# EAGLE design Electric_Imp_imp002_Breakout (EAGLE 7.2.0)
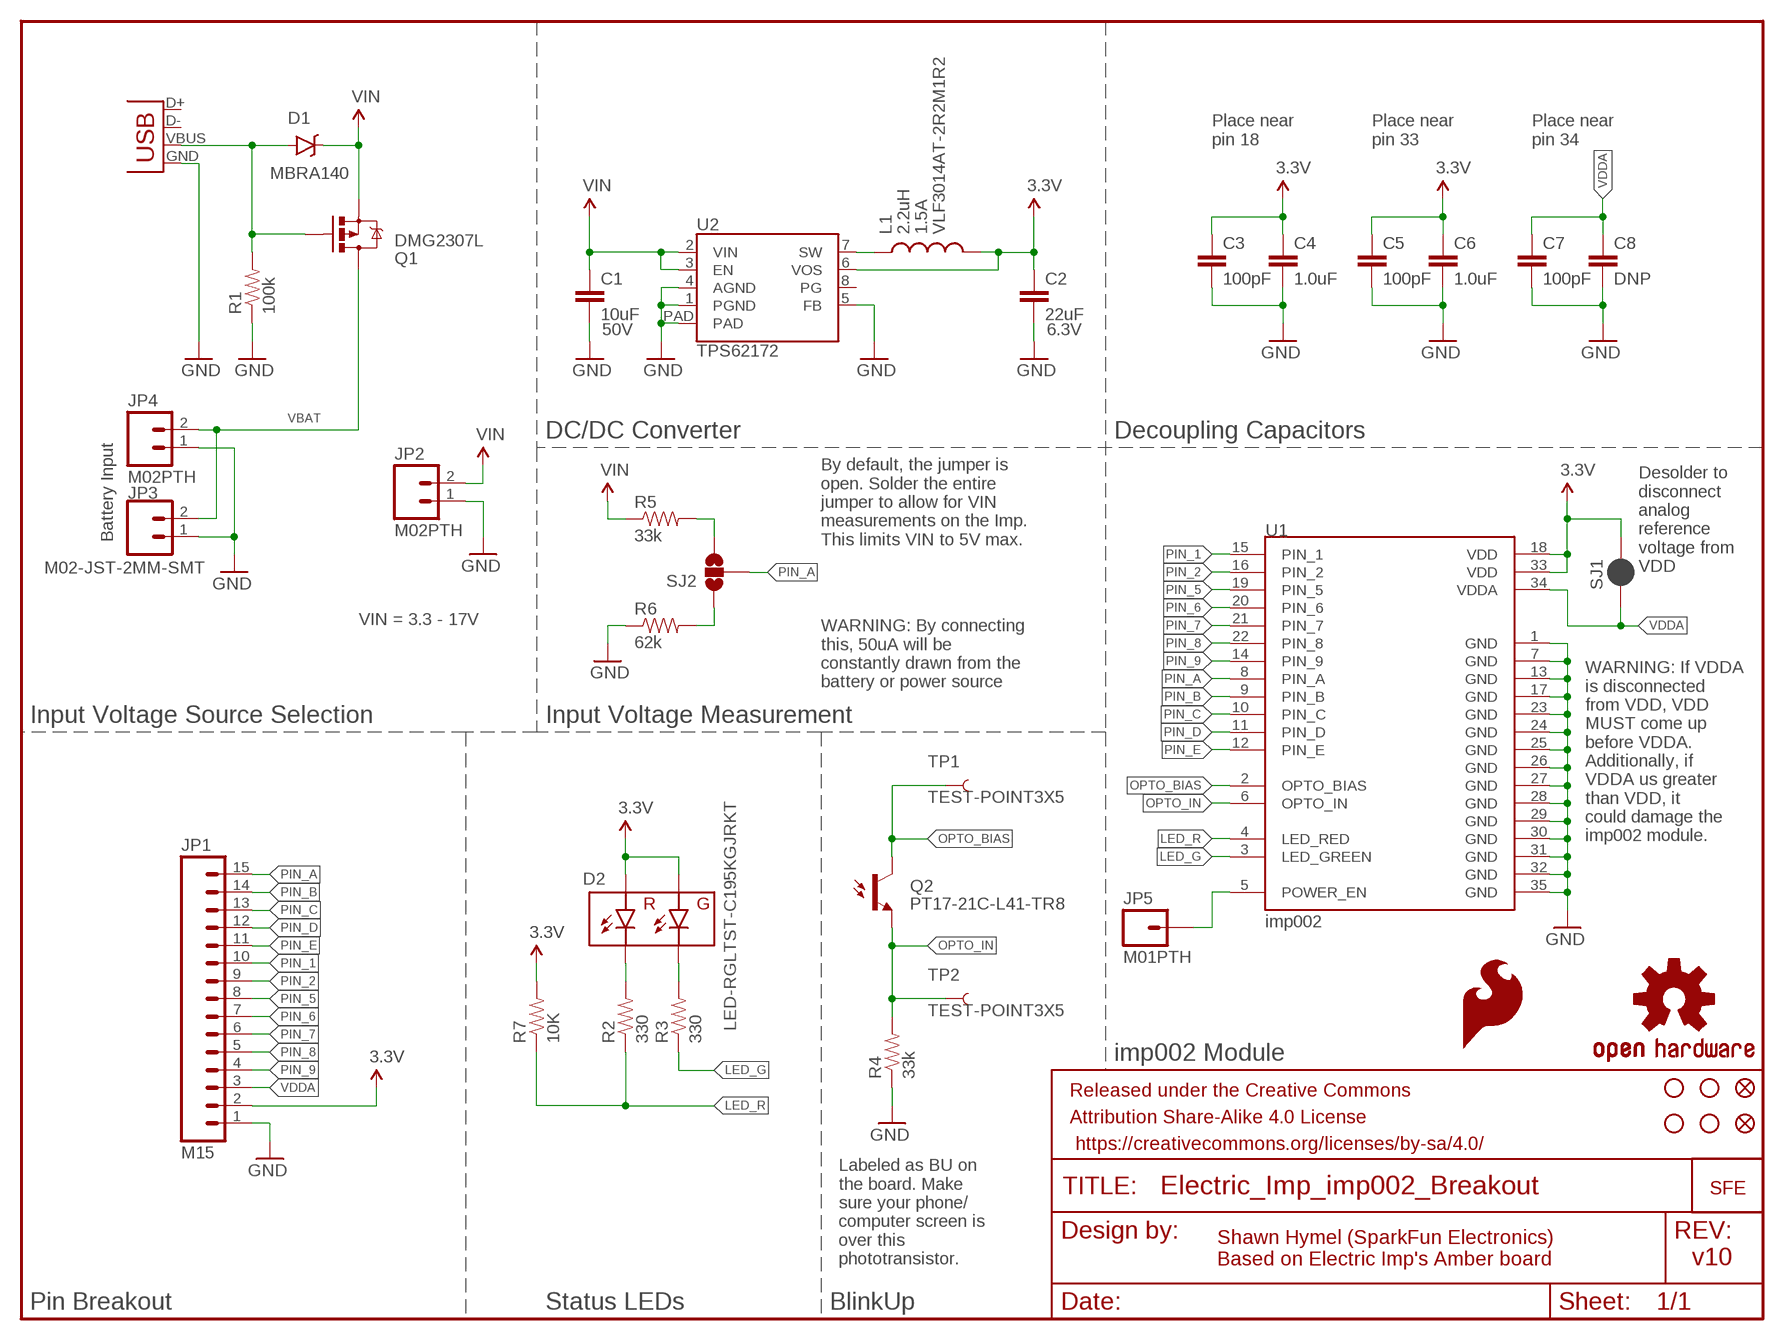
[diagram p0: schematic, sheet 1]

## Parts
C1  10uF  CAP1210  [1210]
C2  22uF  CAP0805  [0805]
C3  100pF  CAP0603-CAP  [0603-CAP]
C4  1.0uF  1.0UF-16V-10%(0603)  [0603-CAP]
C5  100pF  CAP0603-CAP  [0603-CAP]
C6  1.0uF  1.0UF-16V-10%(0603)  [0603-CAP]
C7  100pF  CAP0603-CAP  [0603-CAP]
C8  DNP  CAP0603-CAP  [0603-CAP]
D1  MBRA140  DIODE-SCHOTTKY-MBRA140  [SMA-DIODE]
D2  LED-RGLTST-C195KGJRKT  [LTST-C195KGJRKT]
FID1  FIDUCIAL1X2  [FIDUCIAL-1X2]
FID2  FIDUCIAL1X2  [FIDUCIAL-1X2]
FRAME1  FRAME-LETTER  [CREATIVE_COMMONS]
JP1  M15  [1X15]
JP2  M02PTH  [1X02]
JP3  M02-JST-2MM-SMT  [JST-2-SMD]
JP4  M02PTH  [1X02]
JP5  M01PTH  [1X01]
L1  2.2uH  INDUCTORVLF4012A  [VLF4012A]
LOGO1  OSHW-LOGOS  [OSHW-LOGO-S]
LOGO2  SFE_LOGO_FLAME.1_INCH  [SFE_LOGO_FLAME_.1]
Q1  DMG2307L  MOSFET-PCHANNELDMG2307L  [SOT23-3]
Q2  PT17-21C-L41-TR8  PHOTOTRANSISTORPT17-21C-L41-TR8  [PT17-21C-L41-TR8]
R1  100k  100KOHM1/10W1%(0603)  [0603-RES]
R2  330  330OHM1/10W1%(0603)  [0603-RES]
R3  330  330OHM1/10W1%(0603)  [0603-RES]
R4  33k  33KOHM1/10W1%(0603)  [0603-RES]
R5  33k  33KOHM1/10W1%(0603)  [0603-RES]
R6  62k  RESISTOR0603  [0603-RES]
R7  10K  10KOHM1/10W1%(0603)0603  [0603-RES]
SJ1  JUMPER-PAD-2-NC_BY_PASTE  [PAD-JUMPER-2-NC_BY_PASTE_YES_SILK]
SJ2  JUMPER-PAD-3-NOFULL_BOX_SILK  [PAD-JUMPER-3-NO_YES_SILK_FULL_BOX]
STANDOFF1  STAND-OFF  [STAND-OFF]
STANDOFF2  STAND-OFF  [STAND-OFF]
STANDOFF3  STAND-OFF  [STAND-OFF]
STANDOFF4  STAND-OFF  [STAND-OFF]
TP1  TEST-POINT3X5  [PAD.03X.05]
TP2  TEST-POINT3X5  [PAD.03X.05]
U1  imp002  ELECTRIC_IMP_IMP002  [ELECTRIC_IMP_IMP002]
U2  TPS62172  [WSON-8-PAD]
U$9  SFE_LOGO_NAME_WEB  [SFE-NEW-WEBLOGO]
X1  USBSMD  [USB-MINIB]

## Nets
3.3V: C2.1 C3.1 C4.1 C5.1 C6.1 D2.P$1(GA) D2.P$2(RA) JP1.2 L1.P$2 R7.2 SJ1.2 U1.18(VDD) U1.33(VDD) U2.6(VOS)
GND: C1.2 C2.2 C3.2 C4.2 C5.2 C6.2 C7.2 C8.2 JP1.1 JP2.1 JP3.1 JP4.1 R1.1 R4.1 R6.1 U1.1(GND) U1.7(GND) U1.13(GND) U1.17(GND) U1.23(GND) U1.24(GND) U1.25(GND) U1.26(GND) U1.27(GND) U1.28(GND) U1.29(GND) U1.30(GND) U1.31(GND) U1.32(GND) U1.35(GND) U2.1(PGND) U2.4(AGND) U2.5(FB) U2.PAD X1.GND
LED_G: R3.1 U1.3(LED_GREEN)
LED_R: R2.1 R7.1 U1.4(LED_RED)
N$1: L1.P$1 U2.7(SW)
N$2: D1.A Q1.1(G) R1.2 X1.VBUS
N$4: D2.P$4(RC) R2.2
N$5: D2.P$3(GC) R3.2
N$6: R5.2 SJ2.3
N$7: R6.2 SJ2.1
OPTO_BIAS: Q2.C TP1.P$1 U1.2(OPTO_BIAS)
OPTO_IN: Q2.E R4.2 TP2.P$1 U1.6(OPTO_IN)
PIN_1: JP1.10 U1.15(PIN_1)
PIN_2: JP1.9 U1.16(PIN_2)
PIN_5: JP1.8 U1.19(PIN_5)
PIN_6: JP1.7 U1.20(PIN_6)
PIN_7: JP1.6 U1.21(PIN_7)
PIN_8: JP1.5 U1.22(PIN_8)
PIN_9: JP1.4 U1.14(PIN_9)
PIN_A: JP1.15 SJ2.2 U1.8(PIN_A)
PIN_B: JP1.14 U1.9(PIN_B)
PIN_C: JP1.13 U1.10(PIN_C)
PIN_D: JP1.12 U1.11(PIN_D)
PIN_E: JP1.11 U1.12(PIN_E)
POWER_EN: JP5.1 U1.5(POWER_EN)
VBAT: JP3.2 JP4.2 Q1.3(D)
VDDA: C7.1 C8.1 JP1.3 SJ1.1 U1.34(VDDA)
VIN: C1.1 D1.C JP2.2 Q1.2(S) R5.1 U2.2(VIN) U2.3(EN)
Unconnected: U2.8(PG) X1.D+ X1.D-

## Notes on the sheet
- Place near
  pin 18
- Place near
  pin 33
- Place near
  pin 34
- 1.5A | VLF3014AT-2R2M1R2
- 50V | 6.3V
- DC/DC Converter | Decoupling Capacitors
- Battery Input
- By default, the jumper is
  open. Solder the entire
  jumper to allow for VIN
  measurements on the Imp.
  This limits VIN to 5V max.
- Desolder to 
  disconnect
  analog
  reference 
  voltage from 
  VDD
- VIN = 3.3 - 17V
- WARNING: If VDDA
  is disconnected 
  from VDD, VDD 
  MUST come up
  before VDDA.
  Additionally, if
  VDDA us greater
  than VDD, it 
  could damage the
  imp002 module.
- WARNING: By connecting
  this, 50uA will be
  constantly drawn from the
  battery or power source
- Input Voltage Source Selection | Input Voltage Measurement
- imp002 Module
- Labeled as BU on
  the board. Make
  sure your phone/
  computer screen is
  over this
  phototransistor.
- Shawn Hymel (SparkFun Electronics)
  Based on Electric Imp's Amber board
- v10
- Pin Breakout | Status LEDs | BlinkUp

## Library data of the parts
C1 = SparkFun-Passives:CAP: Capacitor Standard 0603 ceramic capacitor, and 0.1" leaded capacitor.
C2 = SparkFun-Passives:CAP: Capacitor Standard 0603 ceramic capacitor, and 0.1" leaded capacitor.; PROD_ID: CAP-08402
C3 C5 C7 = SparkFun-Capacitors:CAP: Capacitor Standard 0603 ceramic capacitor, and 0.1" leaded capacitor.; PROD_ID: CAP-07883
C4 C6 = SparkFun-Capacitors:1.0UF-16V-10%(0603): CAP-00868; PROD_ID: CAP-00868
C8 = SparkFun-Capacitors:CAP: Capacitor Standard 0603 ceramic capacitor, and 0.1" leaded capacitor.
D1 = SparkFun-DiscreteSemi:DIODE-SCHOTTKY: Schottky diodes in SFE's production catalog BAT20J 1A 23V 0.62Vf RB751 120mA 40V 0.37Vf PMEG4005EJ 0.5A 40V 0.42Vf MBRA140 1A 40V 0.5Vf B340A 3A 40V SMA; PROD_ID: DIO-08053
D2 = SparkFun-LED:LED-RG; PROD_ID: DIO-12140
FID1 FID2 = SparkFun-Aesthetics:FIDUCIAL: Fiducial Alignment Points Various fiducial points for machine vision alignment.
FRAME1 = SparkFun-Aesthetics:FRAME-LETTER: Schematic Frame Standard 8.5x11 US Letter frame
JP1 = SparkFun-Connectors:M15: Header 15 Standard 15-pin 0.1" header. Use with straight break away headers (SKU : PRT-00116), right angle break away headers (PRT-00553), swiss pins (PRT-00743), machine pins (PRT-00117), and female headers (PRT-00115).
JP2 JP4 = SparkFun-Connectors:M02: Standard 2-pin 0.1" header. Use with - straight break away headers ( PRT-00116) - right angle break away headers (PRT-00553) - swiss pins (PRT-00743) - machine pins (PRT-00117) - female headers (PRT-00115) Molex polarized connector foot print use with: PRT-08233 with associated crimp pins and housings. 2.54_SCREWTERM for use with PRT-10571. 3.5mm Screw Terminal footprints for PRT-08084 5mm Screw Terminal footprints for use with PRT-08432
JP3 = SparkFun-Connectors:M02: Standard 2-pin 0.1" header. Use with - straight break away headers ( PRT-00116) - right angle break away headers (PRT-00553) - swiss pins (PRT-00743) - machine pins (PRT-00117) - female headers (PRT-00115) Molex polarized connector foot print use with: PRT-08233 with associated crimp pins and housings. 2.54_SCREWTERM for use with PRT-10571. 3.5mm Screw Terminal footprints for PRT-08084 5mm Screw Terminal footprints for use with PRT-08432; PROD_ID: CONN-08352
JP5 = SparkFun-Connectors:M01: Header 1 Standard 1-pin 0.1" header. Use with straight break away headers (SKU : PRT-00116), right angle break away headers (PRT-00553), swiss pins (PRT-00743), machine pins (PRT-00117), and female headers (PRT-00115).
L1 = SparkFun-Passives:INDUCTOR: Inductors Basic Inductor/Choke - 0603 and 1206. Footprints are not proven and vary greatly between part numbers. SRN6045- 33uH, 20% 1.4A SDR0403-560KL - 56uH, 10%, 500mA RMS/740mA peak
LOGO1 = SparkFun-Aesthetics:OSHW-LOGO: Open Source Hardware Logo This logo indicates the piece of hardware it is found on incorporates a OSHW license and/or adheres to the definition of open source hardware found here: http://freedomdefined.org/OSHW
LOGO2 = SparkFun-Aesthetics:SFE_LOGO_FLAME: SFE Logo, flame only This is the SparkFun flame logo. The logo on the schematic will always be the same size; the package variant is the height of the flame. Default layer for the logo on the board is tSilk.
Q1 = SparkFun-DiscreteSemi:MOSFET-PCHANNEL: Generic PMOSFET IRLML2244 - TRANS-11153 (SOT-23 -20V -4.3A) (1.Gate 2.Source 3.Drain) FQP27P06 - COM-10349 <http://www.sparkfun.com/products/10349> (TO-220 -60V -27A) (1.Gate 2.Source 3.Drain); PROD_ID: TRANS-11308; VALUE: 2.5A/30V
Q2 = SparkFun-DiscreteSemi:PHOTOTRANSISTOR; PROD_ID: TRANS-12141
R1 = SparkFun-Resistors:100KOHM1/10W1%(0603): RES-07828; PROD_ID: RES-07828
R2 R3 = SparkFun-Resistors:330OHM1/10W1%(0603): RES-00818; PROD_ID: RES-00818
R4 R5 = SparkFun-Resistors:33KOHM1/10W1%(0603): RES-08416; PROD_ID: RES-08416
R6 = SparkFun-Resistors:RESISTOR: Resistor Basic schematic elements and footprints for 0603, 1206, and PTH resistors.; PROD_ID: RES-09993
R7 = SparkFun-Resistors:10KOHM1/10W1%(0603): RES-00824; PROD_ID: RES-00824
SJ1 = SparkFun-Passives:JUMPER-PAD-2-NC_BY_PASTE
SJ2 = SparkFun-Passives:JUMPER-PAD-3-NO
STANDOFF1-STANDOFF4 = SparkFun-Electromechanical:STAND-OFF: #4 Stand Off This is the mechanical footprint for a #4 phillips button head screw. Use the keepout ring to avoid running the screw head into surrounding components. SKU : PRT-00447
TP1 TP2 = SparkFun-Passives:TEST-POINT: Bare copper test points for troubleshooting or ICT
U1 = SparkFun-DigitalIC:ELECTRIC_IMP_IMP002; PROD_ID: IC-12130
U2 = SparkFun-PowerIC:TPS62172: Texas Instruments TPS62172 3-17V 0.5A Step-Down Converter with DCS control. Available in adjustable and fixed output voltage versions. Is packaged in an 8-pin WSON package measuring 2 × 2 mm (DSG). See a 3.3V fixed output version of this chip in action on the Electric Imp Breakout Board <https://www.sparkfun.com/products/11400>. Datasheet <http://www.ti.com/lit/gpn/tps62172>; PROD_ID: IC-11307
U$9 = SparkFun-Aesthetics:SFE_LOGO_NAME_WEB: SparkFun.com board silk.
X1 = SparkFun-Connectors:USB: USB Connectors USB-B-PTH is fully proven SKU : PRT-00139/CONN-08278 USB-miniB is fully proven SKU : PRT-00587 USB-A-PCB is untested. USB-A-H is throughly reviewed, but untested. Spark Fun Electronics SKU : PRT-00437 USB-B-SMT is throughly reviewed, but untested. Needs silkscreen touching up. USB-A-S has not been used/tested USB-MB-H has not been used/tested USB-MICROB has been used. CONN-09505; PROD_ID: CONN-08193

## Board
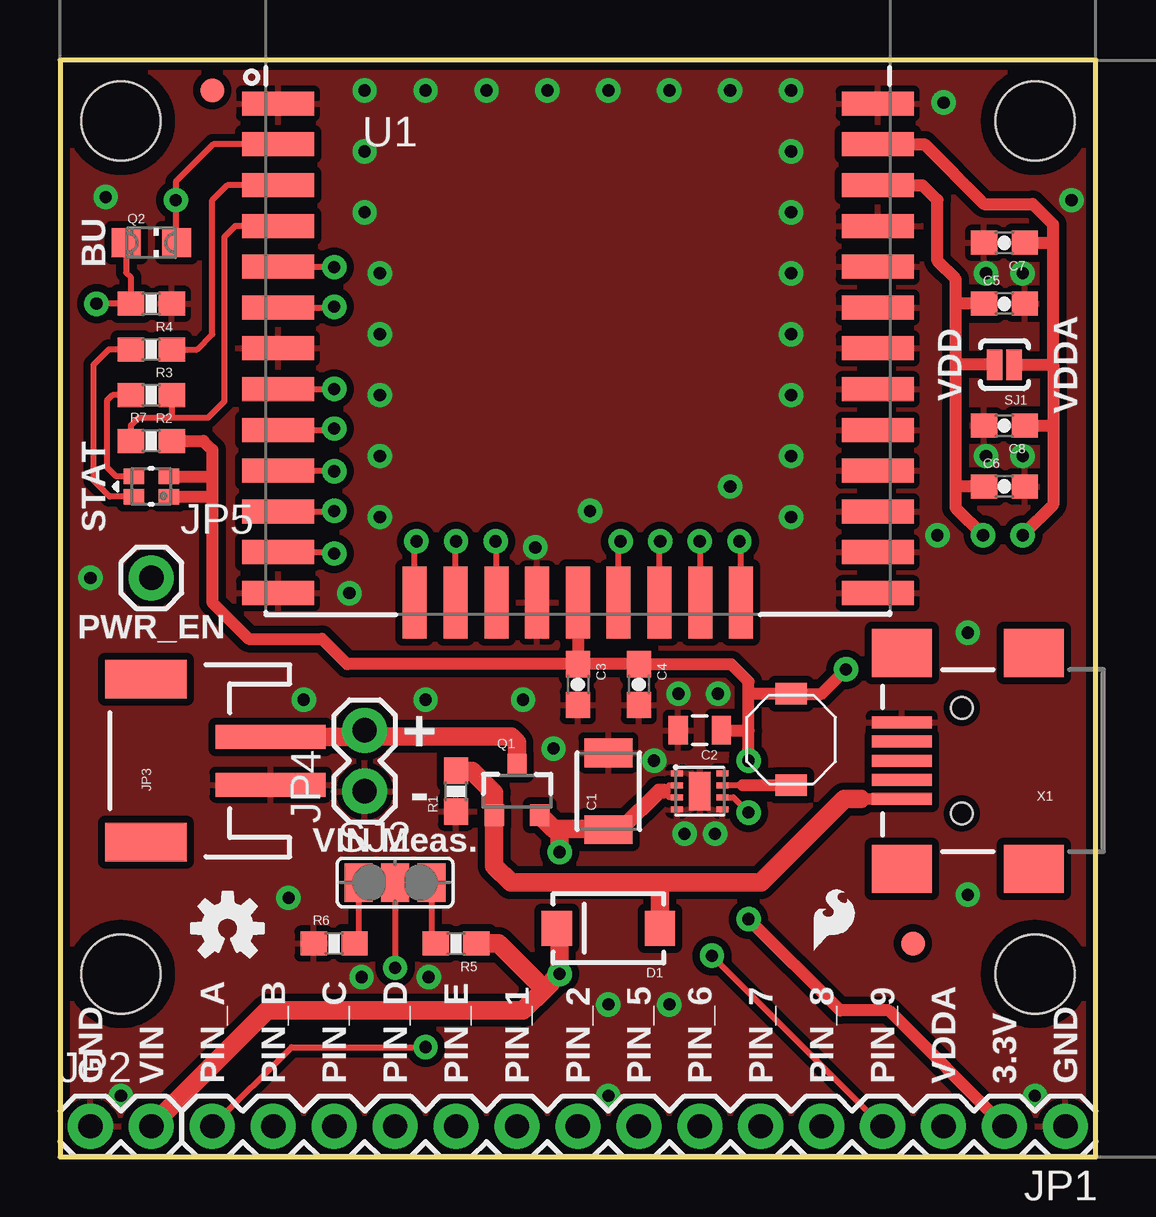
[diagram p1: board, top side]
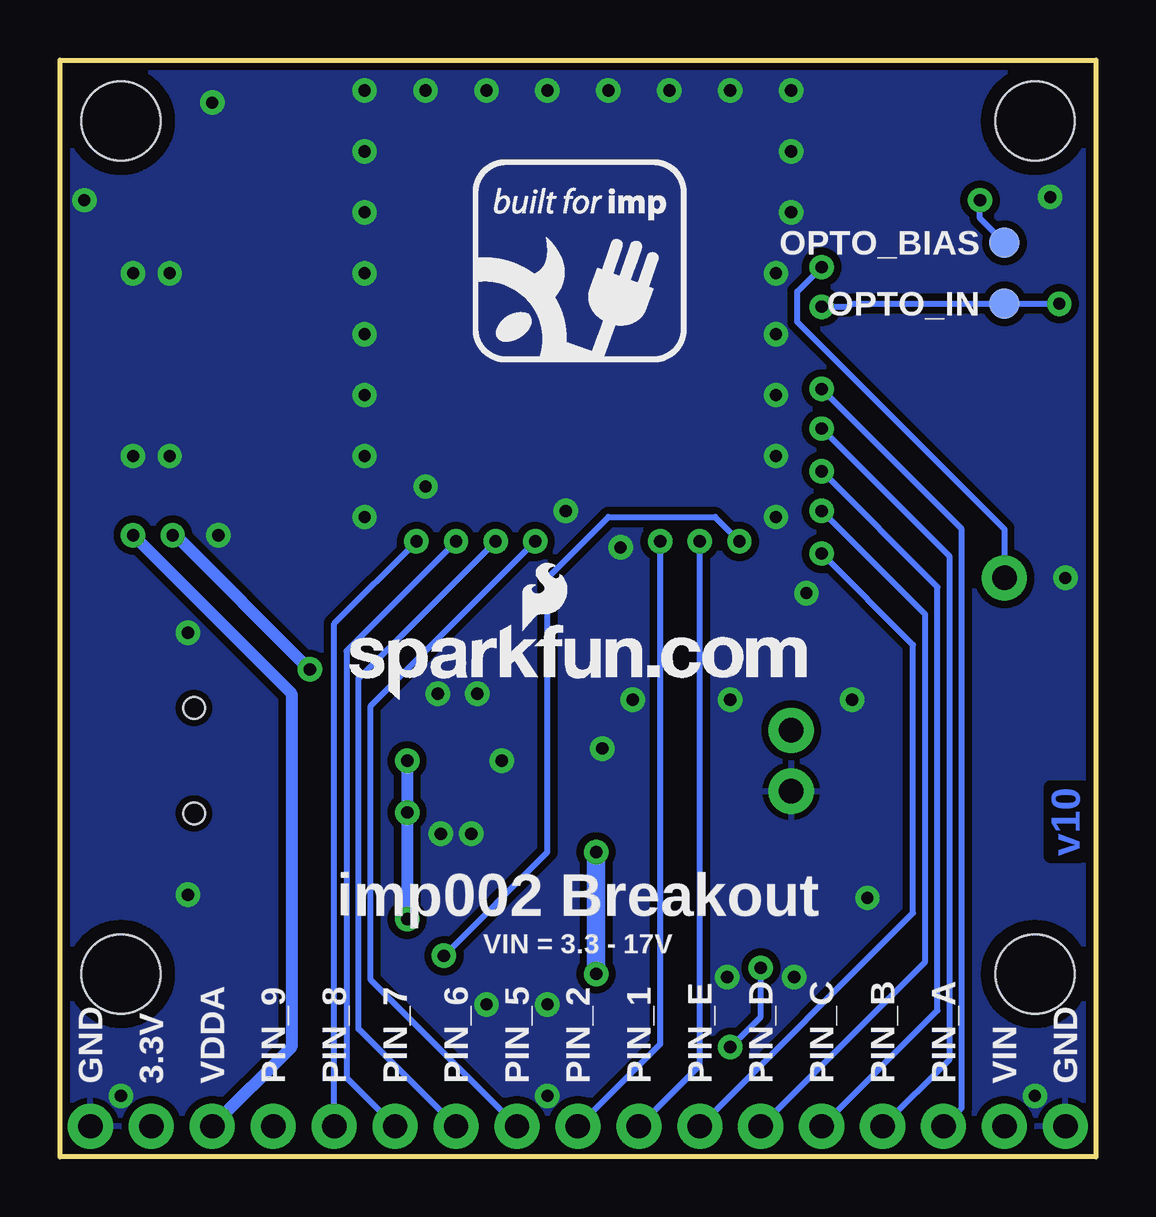
[diagram p2: board, bottom side, seen from below]

Size 43.18 x 45.72 mm. Coordinates in mm from the lower left corner, seen from the top.
Outline: 43.18,45.72 0,45.72 0,0 43.18,0 43.18,45.72
Copper layers (1*16): Top 0.035mm / dielectric 1.5mm / Bottom 0.035mm
Design rules "SparkFun-2-layer": minimum track width 7mil, minimum drill 15mil, track to track 8mil, track to pad 8mil, pad to pad 8mil, via to via 8mil, smd to smd 8mil, copper to edge 8mil, drill to drill 8mil, minimum pad ring 12mil, minimum via ring 10mil, stop-mask expansion 4mil, vias tented up to drill 20mil, thermal gap 10mil
tRestrict: area 33.5,23.1 to 34.5,38.8

### Footprints (pad centres in the part's own frame; a part is rotated, then mirrored left to right if it is on the bottom)
1210 = smd 1.2 x 2: 1 -1.6,0; 2 1.6,0
0805 = smd 0.8 x 1.2: 1 -0.9,0; 2 0.9,0
0603-CAP = smd 1.1 x 1: 1 -0.85,0; 2 0.85,0
SMA-DIODE = smd 1.27 x 1.47: A -2.15,0; C 2.15,0
LTST-C195KGJRKT = smd 0.65 x 0.85: P$1 0.425,0.725; P$2 -0.425,0.725; P$3 0.425,-0.725; P$4 -0.425,-0.725
FIDUCIAL-1X2 = smd 1 x 1: 1 0,0
1X15 = drill 1.016 pad 1.88: 1 0,0; 2 2.54,0; 3 5.08,0; 4 7.62,0; 5 10.16,0; 6 12.7,0; 7 15.24,0; 8 17.78,0; 9 20.32,0; 10 22.86,0; 11 25.4,0; 12 27.94,0; 13 30.48,0; 14 33.02,0; 15 35.56,0
1X02 = drill 1.016 pad 1.88: 1 0,0; 2 2.54,0
JST-2-SMD = smd 1 x 4.6: 1 -1,-3.7; 2 1,-3.7 | smd 1.6 x 3.4: NC1 -3.4,1.5; NC2 3.4,1.5
1X01 = drill 1.016 pad 1.88: 1 0,0
VLF4012A = smd 0.9 x 1.3: P$1 -1.9,0; P$2 1.9,0
SOT23-3 = smd 0.8 x 0.9: 1 -0.95,-1; 2 0.95,-1; 3 0,1.1
PT17-21C-L41-TR8 = smd 1.2 x 1.2: C 0,1.05; E 0,-1.05
0603-RES = smd 1.1 x 1: 1 -0.85,0; 2 0.85,0
PAD-JUMPER-2-NC_BY_PASTE_YES_SILK = smd 0.635 x 1.27: 1 -0.401,0; 2 0.413,0
PAD-JUMPER-3-NO_YES_SILK_FULL_BOX = smd 1.168 x 1.6: 1 -1.524,0; 2 0,0; 3 1.524,0
STAND-OFF = hole 3.302: 0,0
PAD.03X.05 = smd 1.27 x 1.27: P$1 0,0
ELECTRIC_IMP_IMP002 = smd 3 x 1: 1 -12.5,5.8; 2 -12.5,4.1; 3 -12.5,2.4; 4 -12.5,0.7; 5 -12.5,-1; 6 -12.5,-2.7; 7 -12.5,-4.4; 8 -12.5,-6.1; 9 -12.5,-7.8; 10 -12.5,-9.5; 11 -12.5,-11.2; 12 -12.5,-12.9; 13 -12.5,-14.6; 23 12.5,-14.6; 24 12.5,-12.9; 25 12.5,-11.2; 26 12.5,-9.5; 27 12.5,-7.8; 28 12.5,-6.1; 29 12.5,-4.4; 30 12.5,-2.7; 31 12.5,-1; 32 12.5,0.7; 33 12.5,2.4; 34 12.5,4.1; 35 12.5,5.8 | smd 1 x 3: 14 -6.8,-15; 15 -5.1,-15; 16 -3.4,-15; 17 -1.7,-15; 18 0,-15; 19 1.7,-15; 20 3.4,-15; 21 5.1,-15; 22 6.8,-15
WSON-8-PAD = smd 0.25 x 0.5: 1 -0.75,-0.95; 2 -0.25,-0.95; 3 0.25,-0.95; 4 0.75,-0.95; 5 0.75,0.95; 6 0.25,0.95; 7 -0.25,0.95; 8 -0.75,0.95 | smd 1.6 x 0.9: PAD 0,0
USB-MINIB = smd 2.5 x 0.5: D+ 2.5,0; D- 2.5,0.8; GND 2.5,-1.6; ID 2.5,-0.8; VBUS 2.5,1.6 | smd 2.5 x 2: MTN1 -3,4.5; MTN2 2.5,4.5; MTN3 -3,-4.5; MTN4 2.5,-4.5 | hole 0.9: 0,2.2; 0,-2.2

### Placement (x,y rotation side)
C1  22.86,15.24 90 top
C2  26.67,17.78 180 top
C3  21.59,19.68 270 top
C4  24.13,19.68 270 top
C5  39.37,35.56 0 top
C6  39.37,27.94 0 top
C7  39.37,38.1 180 top
C8  39.37,30.48 180 top
D1  22.86,9.53 180 top
D2  3.81,27.94 270 top
FID1  6.35,44.45 0 top
FID2  35.56,8.89 0 top
FRAME1  -15.24,-16.51 0 top  (outside the outline)
JP1  41.91,1.27 180 top
JP2  1.27,1.27 0 top
JP3  5.08,16.51 90 top
JP4  12.7,15.24 90 top
JP5  3.81,24.13 0 top
L1  30.48,17.4 90 top
LOGO1  6.99,9.53 0 top
LOGO2  31.11,8.26 0 top
Q1  19.05,15.24 0 top
Q2  3.81,38.1 270 top
R1  16.51,15.24 90 top
R2  3.81,31.75 180 top
R3  3.81,33.66 180 top
R4  3.81,35.56 180 top
R5  16.51,8.89 180 top
R6  11.43,8.89 0 top
R7  3.81,29.84 0 top
SJ1  39.37,33.02 180 top
SJ2  13.97,11.43 0 top
STANDOFF1  2.54,43.18 0 top
STANDOFF2  40.64,43.18 0 top
STANDOFF3  2.54,7.62 0 top
STANDOFF4  40.64,7.62 0 top
TP1  3.81,38.1 0 bottom
TP2  3.81,35.56 0 bottom
U1  21.59,38.1 0 top
U2  26.67,15.24 270 top
U$9  31.11,19.05 0 bottom
X1  37.59,16.51 180 top

### Tracks (layer width: path | path; a pad name or v marks a point on that pad's centre or on a via)
3.3V  (via drill 0.51)
  Top 0.254: U2.6 28.06,14.99 v28.7,14.35
  Top 0.508: 28.7,19.3 28.71,19.3 L1.P$2 31.75,19.3 v32.77,20.32 | 28.7,19.3 28.7,19.81 27.98,20.54 C4.1 C3.1 | 28.7,17.75 28.7,19.3 | v28.7,16.51 28.7,17.75 | JP1.2 34.54,6.1 32.51,6.1 v28.7,9.91 | U1.33 35.95,40.5 36.58,39.88 36.58,37.34 37.34,36.58 37.34,35.56 | 37.34,27.94 37.34,27.05 v38.48,25.91 | 37.34,27.94 37.34,33.02 | C6.1 37.34,27.94 | SJ1.2 37.34,33.02 | 6.35,28.45 6.35,29.46 5.97,29.84 R7.2 | 6.35,28.45 6.35,27.56 | 6.35,27.56 6.35,23.11 7.87,21.59 10.92,21.59 11.98,20.54 C3.1 | C2.1 28.68,17.78 28.7,17.75 | U1.18 C3.1 | D2.P$1 6.31,27.52 6.35,27.56 | D2.P$2 6.27,28.36 6.35,28.45 | 37.34,33.02 37.34,35.56 | C5.1 37.34,35.56
  Bottom 0.508: v28.7,16.51 v28.7,14.35 v28.7,9.91 | v32.77,20.32 38.35,25.91 v38.48,25.91
GND  (via drill 0.51)
  other vias: 38.61,36.83 40.13,36.83 38.61,29.21 40.13,29.21 12.7,44.45 15.24,44.45 17.78,44.45 20.32,44.45 22.86,44.45 25.4,44.45 27.94,44.45 30.48,44.45 12.7,41.91 12.7,39.37 30.48,41.91 30.48,39.37 13.34,36.83 13.34,34.29 13.34,31.75 13.34,29.21 30.48,36.83 30.48,34.29 30.48,31.75 30.48,29.21 30.48,26.67 27.94,27.94 22.1,26.92 13.34,26.67 12.06,23.5 1.91,40.01 15.24,19.05 10.16,19.05 9.53,10.79 22.86,2.54 22.86,6.35 25.4,6.35 15.37,7.49 12.57,7.49 24.77,16.51 27.3,13.46 26.04,13.46 19.81,25.4 20.57,17.02 40.64,2.54 37.85,10.92 37.85,21.84 36.58,25.91 36.83,43.94 42.16,39.88 2.54,2.54 27.43,19.3 25.78,19.3 19.3,19.05 1.27,24.13
  pour Top (isolate 0.305): 0,45.72 43.18,45.72 43.18,0 0,0
  pour Bottom (isolate 0.305): 0,45.72 43.18,45.72 43.18,0 0,0
LED_G
  Top 0.254: U1.3 6.97,40.5 6.35,39.88 6.35,34.29 5.71,33.66 R3.1
LED_R
  Top 0.254: U1.4 7.3,38.8 6.86,38.35 6.86,31.5 6.17,30.81 4.65,30.81 | R7.1 2.96,30.49 3.28,30.81 4.65,30.81 | R2.1 4.66,30.82 4.65,30.81
N$1
  Top 0.254: U2.7 28.45,15.49
  Top 0.508: 28.45,15.49 L1.P$1
N$2
  Top 0.483: X1.VBUS 33.38,14.91
  Top 0.508: 33.38,14.91
  Top 0.762: 24.89,11.43 18.8,11.43 18.1,12.13 Q1.1 18.1,15.17 17.18,16.09 R1.2 | 24.89,11.43 29.21,11.43 32.69,14.91 33.38,14.91 | D1.A 25.01,11.31 24.89,11.43
N$4
  Top 0.254: D2.P$4 2.34,28.36 1.96,28.75 1.96,31.52 2.18,31.75 R2.2
N$5
  Top 0.254: R3.2 2.03,33.66 1.4,33.02 1.4,28.19 2.08,27.52 D2.P$3
N$6
  Top 0.254: SJ2.3 15.49,9.06 R5.2
N$7
  Top 0.254: SJ2.1 12.45,9.06 R6.2
OPTO_BIAS  (via drill 0.51)
  Top 0.254: U1.2 6.39,42.2 4.83,40.64 v4.83,39.88 4.83,38.13 Q2.C
  Bottom 0.254: TP1.P$1 4.83,39.12 v4.83,39.88
OPTO_IN  (via drill 0.51)
  Top 0.254: Q2.E 2.76,36.86 2.96,36.66 R4.2 v1.52,35.56 | U1.6 11.4,35.4 v11.43,35.43
  Bottom 0.254: v1.52,35.56 TP2.P$1 10.16,35.56 10.29,35.43 v11.43,35.43
PIN_1  (via drill 0.51)
  Top 0.254: U1.15 16.49,25.63 v16.51,25.65
  Bottom 0.254: JP1.10 16.51,3.81 v16.51,25.65
PIN_2  (via drill 0.51)
  Top 0.254: U1.16 18.19,25.62 v18.16,25.65
  Bottom 0.254: JP1.9 18.16,4.7 v18.16,25.65
PIN_5  (via drill 0.51)
  Top 0.254: U1.19 23.29,25.58 v23.37,25.65
  Bottom 0.254: JP1.8 30.23,7.37 30.23,18.8 v23.37,25.65
PIN_6  (via drill 0.51)
  Top 0.254: U1.20 24.99,25.62 v25.02,25.65
  Bottom 0.254: JP1.7 30.73,5.33 30.73,19.94 30.48,20.19 30.29,20.38 v25.02,25.65
PIN_7  (via drill 0.51)
  Top 0.254: U1.21 26.69,25.63 v26.67,25.65
  Bottom 0.254: JP1.6 31.24,3.3 31.24,21.08 v26.67,25.65
PIN_8  (via drill 0.51)
  Top 0.254: U1.22 28.39,25.59 v28.32,25.65
  Bottom 0.254: JP1.5 31.75,22.23 v28.32,25.65
PIN_9  (via drill 0.51)
  Top 0.254: JP1.4 v27.18,8.38 | U1.14 14.79,25.59 v14.86,25.65
  Bottom 0.254: v14.86,25.65 15.88,26.67 20.32,26.67 22.86,24.13 22.86,12.7 v27.18,8.38
PIN_A  (via drill 0.51)
  Top 0.254: JP1.15 9.65,4.57 v15.24,4.57 | SJ2.2 v13.97,7.87 | U1.8 v11.43,32
  Bottom 0.254: JP1.15 5.59,2.03 5.59,26.16 v11.43,32 | v15.24,4.57 13.97,5.84 v13.97,7.87
PIN_B  (via drill 0.51)
  Top 0.254: U1.9 11.38,30.3 v11.43,30.35
  Bottom 0.254: JP1.14 6.1,4.06 6.1,25.02 v11.43,30.35
PIN_C  (via drill 0.51)
  Top 0.254: U1.10 11.4,28.6 v11.43,28.57
  Bottom 0.254: JP1.13 6.6,6.1 6.6,23.75 v11.43,28.57
PIN_D  (via drill 0.51)
  Top 0.254: U1.11 11.41,26.9 v11.43,26.92
  Bottom 0.254: JP1.12 7.11,8.13 7.11,22.61 v11.43,26.92
PIN_E  (via drill 0.51)
  Top 0.254: U1.12 11.38,25.2 v11.43,25.15
  Bottom 0.254: JP1.11 7.62,10.16 7.62,21.34 v11.43,25.15
POWER_EN  (via drill 0.51)
  Top 0.254: U1.5 11.41,37.1 v11.43,37.08
  Bottom 0.254: v11.43,37.08 12.45,36.07 12.45,34.8 3.81,26.16 JP5.1
VBAT
  Top 0.762: Q1.3 19.05,17.27 18.8,17.53 12.95,17.53 JP4.2 12.43,17.51 JP3.2
VDDA  (via drill 0.51)
  Top 0.508: U1.34 36.03,42.2 38.52,39.71 40.55,39.71 41.4,38.86 41.4,38.1 | 41.4,33.02 41.4,30.48 | 41.4,30.48 41.4,27.18 v40.13,25.91 | C8.1 41.4,30.48 | SJ1.1 41.4,33.02 | 41.4,33.02 41.4,38.1 | C7.1 41.4,38.1
  Bottom 0.508: JP1.3 33.53,4.57 33.53,19.3 v40.13,25.91
VIN  (via drill 0.51)
  Top 0.254: U2.2 25.4,15.49 25.15,15.24 25.4,14.99 U2.3
  Top 0.635: 25.15,15.24 24.97,15.24 23.39,13.66 22.89,13.66 C1.1
  Top 0.762: Q1.2 20.57,13.66 20.83,13.66 | 20.83,13.66 22.84,13.66 C1.1 | v20.83,12.7 20.83,13.66 | 20.19,6.99 v20.83,7.62 20.83,9.41 D1.C | R5.1 18.29,8.89 20.19,6.99 | 20.19,6.99 19.3,6.1 8.64,6.1 JP2.2
  Bottom 0.762: v20.83,12.7 v20.83,7.62

### Text on the board
Bottom: v10
tPlace: BU | VDD | VDDA | STAT | PWR_EN | + | - | VIN Meas. | GND | VIN | PIN_A | PIN_B | PIN_C | PIN_D | PIN_E | PIN_1 | PIN_2 | PIN_5 | PIN_6 | PIN_7 | PIN_8 | PIN_9 | VDDA | 3.3V | GND
bPlace: OPTO_BIAS | OPTO_IN | imp002 Breakout | VIN = 3.3 - 17V | GND | VIN | PIN_A | PIN_B | PIN_C | PIN_D | PIN_E | PIN_1 | PIN_2 | PIN_5 | PIN_6 | PIN_7 | PIN_8 | PIN_9 | VDDA | 3.3V | GND
tDocu: Shawn Hymel (SparkFun Electronics) / Based on Electric Imp's Amber board